# EAGLE design Main_PCB_v2.2 (EAGLE 7.3.0)
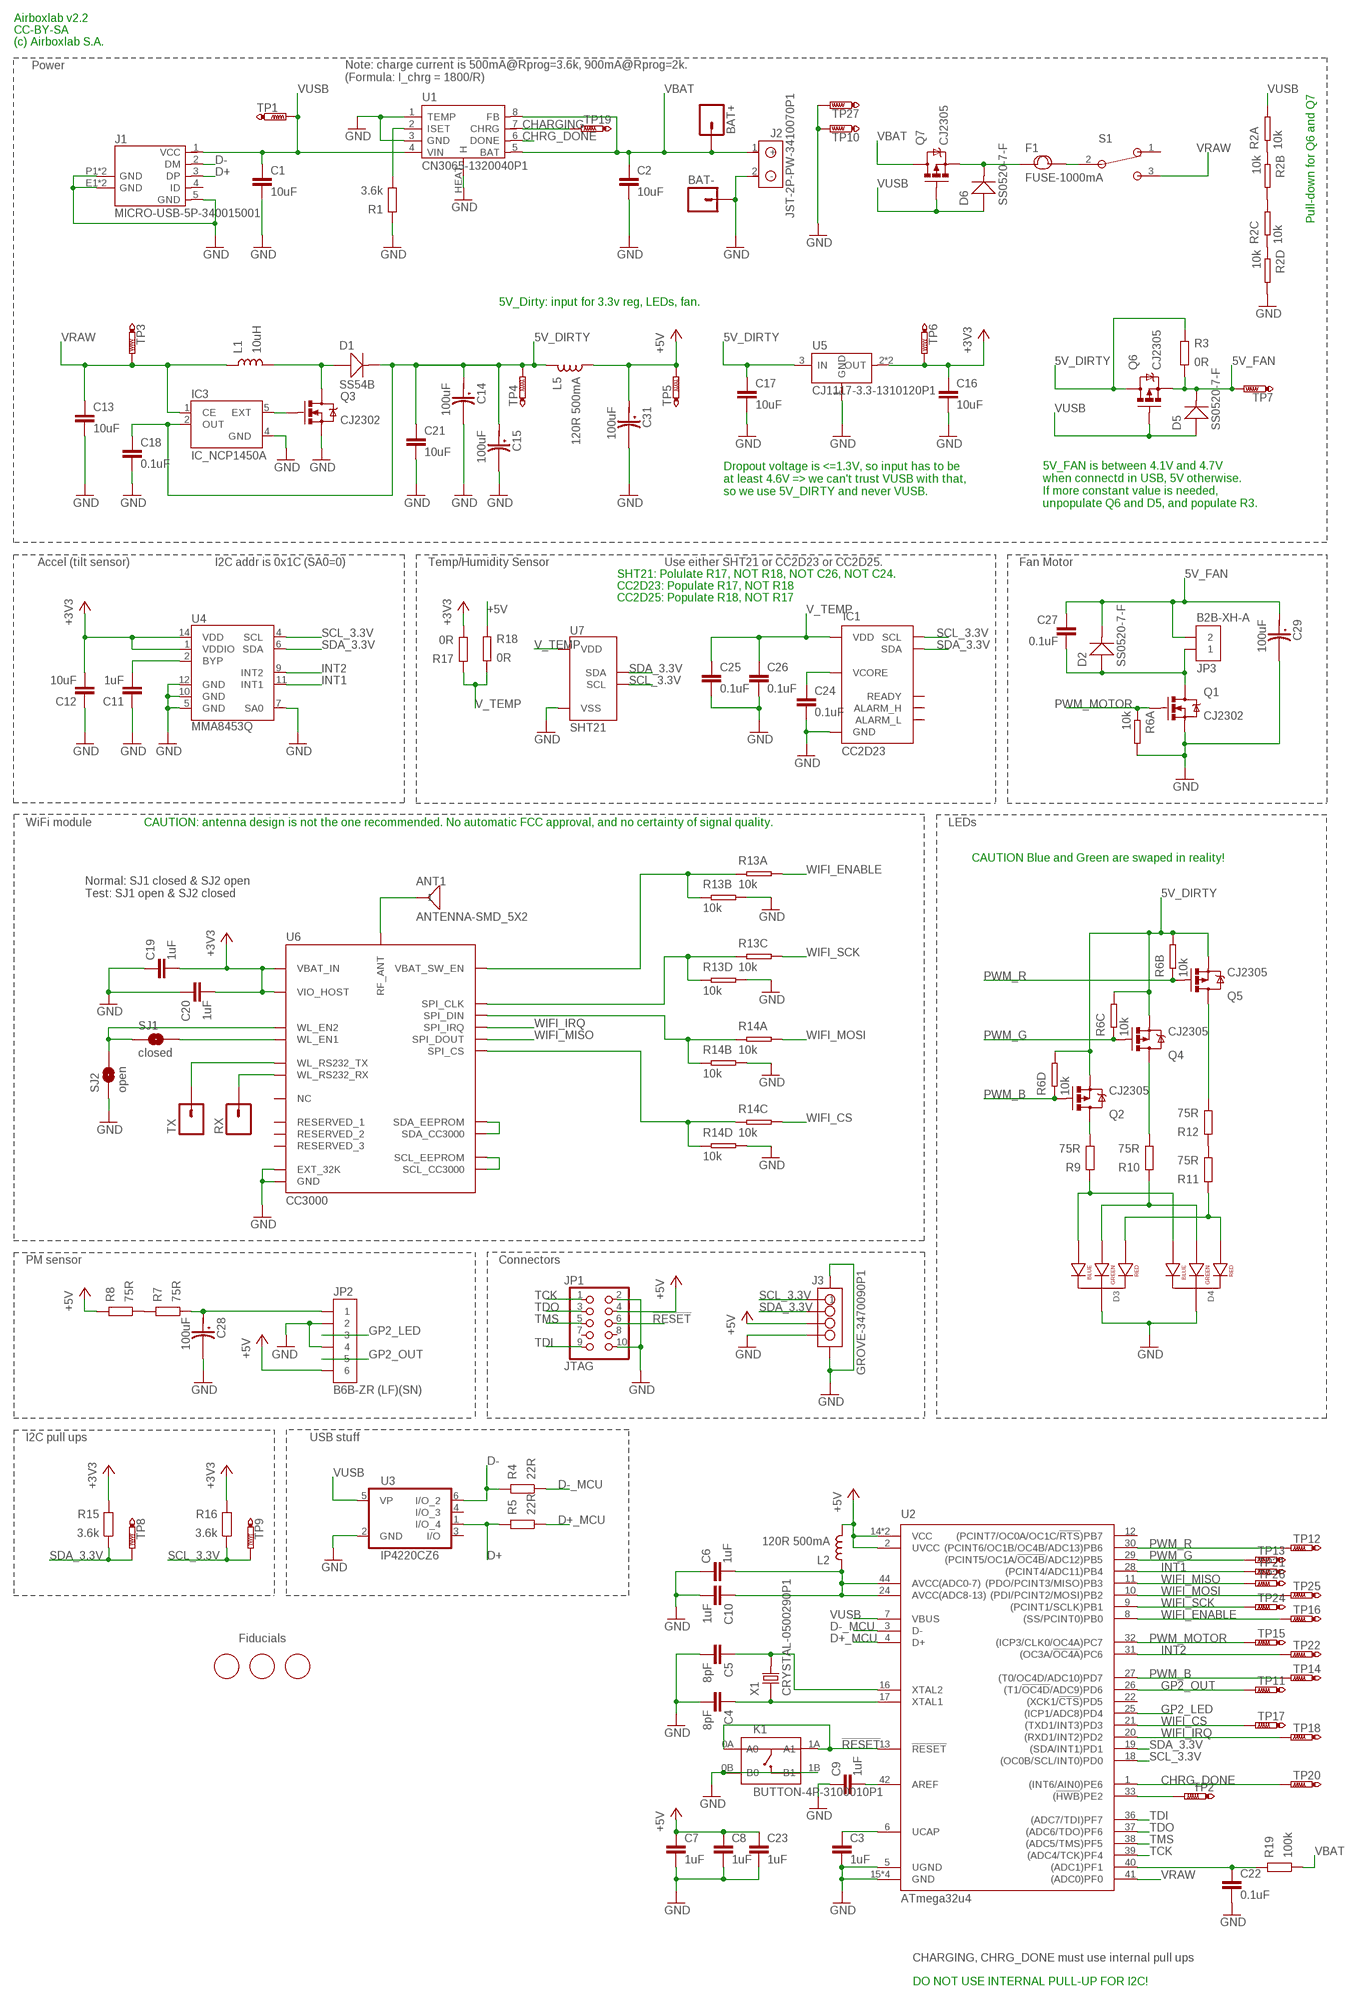
[diagram p0: schematic, sheet 1]

## Parts
ANT1  ANTENNA-SMD_5X2  [ANTENNA_SMD_5X2]
BAT+  M01PTH  [1X01]
BAT-  M01PTH  [1X01]
C1  10uF  C0805  [0805_N]
C2  10uF  C0805  [0805_N]
C3  1uF  C0603  [0603_N]
C4  8pF  C0603  [0603_N]
C5  8pF  C0603  [0603_N]
C6  1uF  C0603  [0603_N]
C7  1uF  C0603  [0603_N]
C8  1uF  C0603  [0603_N]
C9  1uF  C0603  [0603_N]
C10  1uF  C0603  [0603_N]
C11  1uF  C0603  [0603_N]
C12  10uF  C0805  [0805_N]
C13  10uF  C0805  [0805_N]
C14  100uF  C-POLAR-C  [AVX-C]
C15  100uF  C-POLAR-C  [AVX-C]
C16  10uF  C0805  [0805_N]
C17  10uF  C0805  [0805_N]
C18  0.1uF  C0603  [0603_N]
C19  1uF  C0603  [0603_N]
C20  1uF  C0603  [0603_N]
C21  10uF  C0805  [0805_N]
C22  0.1uF  C0603  [0603_N]
C23  1uF  C0603  [0603_N]
C24  0.1uF  C0603  [0603_N]
C25  0.1uF  C0603  [0603_N]
C26  0.1uF  C0603  [0603_N]
C27  0.1uF  C0603  [0603_N]
C28  100uF  C-POLAR-C  [AVX-C]
C29  100uF  C-POLAR-C  [AVX-C]
C31  100uF  C-POLAR-C  [AVX-C]
D1  SS54B  D-SMB  [SMB]
D2  SS0520-7-F  D-SOD-123  [SOD123]
D3  LED-RGB-CC-THRUCLEAR  [LED-RGB-THRU]
D4  LED-RGB-CC-THRUCLEAR  [LED-RGB-THRU]
D5  SS0520-7-F  D-SOD-123  [SOD123]
D6  SS0520-7-F  D-SOD-123  [SOD123]
F1  FUSE-1000mA  FUSE-1206  [F1206]
IC1  CC2D23  CC2DXX  [CC2DXX]
IC3  IC_NCP1450A  [SOT-23-5_N]
J1  MICRO-USB-5P-340015001  [B-SMD-5P]
J2  JST-2P-PW-3410070P1  [2P-2.0-90D]
J3  GROVE-3470090P1  GROVE-4P-2.0-SMD-FEMALE-REINFORCE-3470090P1  [4P-SMD-2.0]
JP1  JTAG  CONNECTOR_5X2_2.54MM_LOCK  [CONNECTOR_2.54MM_5X2_LOCK]
JP2  B6B-ZR (LF)(SN)  CONNECTOR_6X1-ZR-THT  [CONNECTOR_B6B-ZR]
JP3  B2B-XH-A  CONNECTOR_2X1  [CONNECTOR_B2B-XH-A]
K1  BUTTON-4P-3100010P1  [4P-SMD-6.0X6.0X5.0H]
L1  10uH  L-SMD_8X8  [L_SRU8043]
L2  120R 500mA  L0603  [0603_N]
L5  120R 500mA  L0603  [0603_N]
Q1  CJ2302  MOSFET_N_SOT23-3  [SOT-23-3_N/SSOT-3_N]
Q2  CJ2305  MOSFET_P_FDN308P  [SOT-23-3_N/SSOT-3_N]
Q3  CJ2302  MOSFET_N_SOT23-3  [SOT-23-3_N/SSOT-3_N]
Q4  CJ2305  MOSFET_P_FDN308P  [SOT-23-3_N/SSOT-3_N]
Q5  CJ2305  MOSFET_P_FDN308P  [SOT-23-3_N/SSOT-3_N]
Q6  CJ2305  MOSFET_P_FDN308P  [SOT-23-3_N/SSOT-3_N]
Q7  CJ2305  MOSFET_P_FDN308P  [SOT-23-3_N/SSOT-3_N]
R1  3.6k  R0603  [0603_N]
R2  10k  R-4R  [R1206-8]
R3  0R  R0603  [0603_N]
R4  22R  R0603  [0603_N]
R5  22R  R0603  [0603_N]
R6  10k  R-4R  [R1206-8]
R7  75R  R0603  [0603_N]
R8  75R  R0603  [0603_N]
R9  75R  R0603  [0603_N]
R10  75R  R0603  [0603_N]
R11  75R  R0603  [0603_N]
R12  75R  R0603  [0603_N]
R13  10k  R-4R  [R1206-8]
R14  10k  R-4R  [R1206-8]
R15  3.6k  R0603  [0603_N]
R16  3.6k  R0603  [0603_N]
R17  0R  R0603  [0603_N]
R18  0R  R0603  [0603_N]
R19  100k  R0603  [0603_N]
RX  M01PTH  [1X01]
S1  SWITCH_SPDT_ON-ON  [SWITCH_SPDT_OS102011MA1QN1]
SJ1  closed  SOLDERJUMPER2_TRACE2  [SJ_2S-TRACE2]
SJ2  open  SOLDERJUMPER2NO  [SJ_2S-NO]
TP1  PTR1PAD1-13  [P1-13]
TP2  PTR1B1,27  [B1,27]
TP3  PTR1PAD1-13  [P1-13]
TP4  PTR1PAD1-13  [P1-13]
TP5  PTR1PAD1-13  [P1-13]
TP6  PTR1PAD1-13  [P1-13]
TP7  PTR1PAD1-13  [P1-13]
TP8  PTR1PAD1-13  [P1-13]
TP9  PTR1PAD1-13  [P1-13]
TP10  PTR1PAD1-13  [P1-13]
TP11  PTR1PAD1-13  [P1-13]
TP12  PTR1B1,27  [B1,27]
TP13  PTR1B1,27  [B1,27]
TP14  PTR1B1,27  [B1,27]
TP15  PTR1B1,27  [B1,27]
TP16  PTR1B1,27  [B1,27]
TP17  PTR1B1,27  [B1,27]
TP18  PTR1B1,27  [B1,27]
TP19  PTR1B1,27  [B1,27]
TP20  PTR1B1,27  [B1,27]
TP21  PTR1B1,27  [B1,27]
TP22  PTR1B1,27  [B1,27]
TP24  PTR1B1,27  [B1,27]
TP25  PTR1B1,27  [B1,27]
TP26  PTR1B1,27  [B1,27]
TP27  PTR1PAD1-13Y  [P1-13Y]
TX  M01PTH  [1X01]
U1  CN3065-1320040P1  [DFN8]
U2  ATmega32u4  IC_ATMEGAXXU4-MU  [QFN-44_50P_N]
U3  IP4220CZ6  [SOT95P275X110-6N]
U4  MMA8453Q  MMA8452Q  [QFN-16_0.5MM]
U5  CJ1117-3.3-1310120P1  [SOT89]
U6  CC3000  [CC3000]
U7  SHT21  SHT2X-21  [SHT2X]
U$1  FIDUCIAL  [FIDUCIAL_1MM]
U$2  FIDUCIAL  [FIDUCIAL_1MM]
U$3  FIDUCIAL  [FIDUCIAL_1MM]
X1  CRYSTAL-0500290P1  [2P-SMD-5.0X3.2]

## Nets
5V_DIRTY: C14.+ C15.+ C17.1 C18.1 C21.1 D1.- IC3.2(OUT) L5.1 Q2.2(S) Q4.2(S) Q5.2(S) Q6.3(D) R3.2 R6.5 R6.6 R6.7 TP4.TP U5.3(IN)
5V_FAN: C27.1 C29.+ D2.- D5.- JP3.2 Q6.2(S) R3.1 TP7.TP
!RESET!: JP1.6 K1.0A(A0) K1.1A(A1) U2.13(!RESET!)
+3V3: C12.2 C16.1 C19.2 C20.2 R15.2 R16.2 R17.1 TP6.TP U4.1(VDDIO) U4.14(VDD) U5.2(OUT) U5.4(OUT) U6.P$19(VBAT_IN) U6.P$23(VIO_HOST)
+5V: C7.1 C8.1 C23.1 C31.+ J3.3 JP1.4 JP2.P$6 L2.2 L5.2 R8.2 R18.2 TP5.TP U2.2(UVCC) U2.14(VCC) U2.34(VCC)
CHARGING: TP19.TP U1.7(CHRG)
CHRG_DONE: TP20.TP U1.6(DONE) U2.1((INT6/AIN0)PE6)
D+: J1.3(DP) R5.2 U3.1(I/O_4)
D+_MCU: R5.1 U2.4(D+)
D-: J1.2(DM) R4.2 U3.6(I/O_2)
D-_MCU: R4.1 U2.3(D-)
GND: BAT-.1 C1.2 C2.2 C3.2 C4.2 C5.2 C6.1 C7.2 C8.2 C9.1 C10.2 C11.1 C12.1 C13.2 C14.- C15.- C16.2 C17.2 C18.2 C19.1 C20.1 C21.2 C22.2 C23.2 C24.2 C25.2 C26.2 C28.- C29.- C31.- D3.2(CATHODE) D4.2(CATHODE) IC1.P$6(GND) IC3.4(GND) J1.5(GND) J1.E1(GND) J1.E2(GND) J1.P1(GND) J1.P2(GND) J2.2(-) J3.4 J3.SS1 J3.SS2 JP1.2 JP1.10 JP2.P$2 JP2.P$4 K1.0B(B0) K1.1B(B1) Q1.2(S) Q3.2(S) R1.2 R2.5 R6.8 R13.5 R13.7 R14.5 R14.7 SJ2.1 TP10.TP TP27.TP U1.1(TEMP) U1.3(GND) U1.HEAT(H) U2.5(UGND) U2.15(GND) U2.23(GND) U2.35(GND) U2.43(GND) U3.2(GND) U4.5(GND) U4.7(SA0) U4.10(GND) U4.12(GND) U5.1(GND) U6.P$1(GND) U6.P$9(GND) U6.P$10(GND) U6.P$11(GND) U6.P$16(GND) U6.P$18(GND) U6.P$20(GND) U6.P$21(EXT_32K) U6.P$22(GND) U6.P$25(GND) U6.P$31(GND) U6.P$32(GND) U6.P$33(GND) U6.P$34(GND) U6.P$36(GND) U6.P$37(GND) U6.P$38(GND) U6.P$39(GND) U6.P$40(GND) U6.P$41(GND) U6.P$42(GND) U6.P$43(GND) U6.P$44(GND) U6.P$45(GND) U6.P$46(GND) U7.0(VSS) U7.2(VSS)
GP2_LED: JP2.P$3 U2.25((ICP1/ADC8)PD4)
GP2_OUT: JP2.P$5 TP11.TP U2.26((T1/!OC4D!/ADC9)PD6)
INT1: TP21.TP U2.28((PCINT4/ADC11)PB4) U4.11(INT1)
INT2: TP22.TP U2.31((OC3A/!OC4A!)PC6) U4.9(INT2)
N$1: R1.1 U1.2(ISET)
N$2: D6.- F1.1 Q7.2(S)
N$3: D1.+ L1.P$2 Q3.3(D)
N$4: C11.2 U4.2(BYP)
N$5: C3.1 U2.6(UCAP)
N$6: C4.1 U2.17(XTAL1) X1.1
N$7: C5.1 U2.16(XTAL2) X1.2
N$8: C6.2 C10.1 L2.1 U2.24(AVCC(ADC8-13)) U2.44(AVCC(ADC0-7))
N$9: IC3.5(EXT) Q3.1(G)
N$10: U6.P$27(SDA_EEPROM) U6.P$28(SDA_CC3000)
N$11: C9.2 U2.42(AREF)
N$12: F1.2 S1.2
N$13: R2.1 R2.2
N$14: R2.6 R2.7
N$15: R2.3 R2.4
N$16: U6.P$29(SCL_EEPROM) U6.P$30(SCL_CC3000)
N$17: Q5.3(D) R12.1
N$18: Q4.3(D) R10.1
N$19: Q2.3(D) R9.1
N$20: C27.2 D2.+ JP3.1 Q1.3(D)
N$21: C28.+ JP2.P$1 R7.1
N$22: C22.1 R19.2 U2.40((ADC1)PF1)
N$23: R7.2 R8.1
N$24: C24.1 IC1.P$5(VCORE)
N$25: TX.1 U6.P$6(WL_RS232_TX)
N$26: SJ1.2 U6.P$7(WL_EN1)
N$27: SJ1.1 SJ2.2 U6.P$5(WL_EN2)
N$28: RX.1 U6.P$8(WL_RS232_RX)
N$29: ANT1.1 U6.P$35(RF_ANT)
N$32: D3.4(BLUE_CATHODE) D4.4(BLUE_CATHODE) R9.2
N$33: D3.3(GREEN_CATHODE) D4.3(GREEN_CATHODE) R10.2
N$34: R11.1 R12.2
N$37: D3.1(RED_CATHODE) D4.1(RED_CATHODE) R11.2
N$39: R14.3 R14.4 U6.P$12(SPI_CS)
N$40: R14.1 R14.2 U6.P$15(SPI_DIN)
N$41: R13.3 R13.4 U6.P$17(SPI_CLK)
N$42: R13.1 R13.2 U6.P$26(VBAT_SW_EN)
N$43: TP2.TP U2.33((!HWB!)PE2)
PWM_B: Q2.1(G) R6.4 TP14.TP U2.27((T0/OC4D/ADC10)PD7)
PWM_G: Q4.1(G) R6.3 TP13.TP U2.29((PCINT5/OC1A/!OC4B!/ADC12)PB5)
PWM_MOTOR: Q1.1(G) R6.1 TP15.TP U2.32((ICP3/CLK0/OC4A)PC7)
PWM_R: Q5.1(G) R6.2 TP12.TP U2.30((PCINT6/OC1B/OC4B/ADC13)PB6)
SCL_3.3V: IC1.P$4(SCL) J3.1 R16.1 TP9.TP U2.18((OC0B/SCL/INT0)PD0) U4.4(SCL) U7.6(SCL)
SDA_3.3V: IC1.P$3(SDA) J3.2 R15.1 TP8.TP U2.19((SDA/INT1)PD1) U4.6(SDA) U7.1(SDA)
TCK: JP1.1 U2.39((ADC4/TCK)PF4)
TDI: JP1.9 U2.36((ADC7/TDI)PF7)
TDO: JP1.3 U2.37((ADC6/TDO)PF6)
TMS: JP1.5 U2.38((ADC5/TMS)PF5)
V_TEMP: C25.1 C26.1 IC1.P$7(VDD) R17.2 R18.1 U7.5(VDD)
VBAT: BAT+.1 C2.1 J2.1(+) Q7.3(D) R19.1 U1.5(BAT) U1.8(FB)
VRAW: C13.1 IC3.1(CE) L1.P$1 S1.3 TP3.TP U2.41((ADC0)PF0)
VUSB: C1.1 D5.+ D6.+ J1.1(VCC) Q6.1(G) Q7.1(G) R2.8 TP1.TP U1.4(VIN) U2.7(VBUS) U3.5(VP)
WIFI_CS: R14.6 TP17.TP U2.21((TXD1/INT3)PD3)
WIFI_ENABLE: R13.8 TP16.TP U2.8((SS/PCINT0)PB0)
WIFI_IRQ: TP18.TP U2.20((RXD1/INT2)PD2) U6.P$14(SPI_IRQ)
WIFI_MISO: TP26.TP U2.11((PDO/PCINT3/MISO)PB3) U6.P$13(SPI_DOUT)
WIFI_MOSI: R14.8 TP25.TP U2.10((PDI/PCINT2/MOSI)PB2)
WIFI_SCK: R13.6 TP24.TP U2.9((PCINT1/SCLK)PB1)
Unconnected: IC1.P$1(ALARM_L) IC1.P$2(READY) IC1.P$8(ALARM_H) J1.4(ID) JP1.7 JP1.8 S1.1 U2.12((PCINT7/OC0A/OC1C/!RTS!)PB7) U2.22((XCK1/!CTS!)PD5) U3.3(I/O) U3.4(I/O_3) U6.P$2(RESERVED_1) U6.P$3(NC) U6.P$4(RESERVED_2) U6.P$24(RESERVED_3)

## Notes on the sheet
- Airboxlab v2.2
- CC-BY-SA
- (c) Airboxlab S.A.
- Power
- Note: charge current is 500mA@Rprog=3.6k, 900mA@Rprog=2k.
  (Formula: I_chrg = 1800/R)
- Pull-down for Q6 and Q7
- 5V_Dirty: input for 3.3v reg, LEDs, fan.
- Dropout voltage is <=1.3V, so input has to be
  at least 4.6V => we can't trust VUSB with that,
  so we use 5V_DIRTY and never VUSB.
- 5V_FAN is between 4.1V and 4.7V
  when connectd in USB, 5V otherwise.
  If more constant value is needed,
  unpopulate Q6 and D5, and populate R3.
- Accel (tilt sensor) | I2C addr is 0x1C (SA0=0) | Temp/Humidity Sensor | Use either SHT21 or CC2D23 or CC2D25. | Fan Motor
- SHT21: Polulate R17, NOT R18, NOT C26, NOT C24.
- CC2D23: Populate R17, NOT R18
- CC2D25: Populate R18, NOT R17
- WiFi module | CAUTION: antenna design is not the one recommended. No automatic FCC approval, and no certainty of signal quality. | LEDs
- CAUTION Blue and Green are swaped in reality!
- Normal: SJ1 closed & SJ2 open
  Test: SJ1 open & SJ2 closed
- PM sensor | Connectors
- I2C pull ups | USB stuff
- Fiducials
- CHARGING, CHRG_DONE must use internal pull ups
- DO NOT USE INTERNAL PULL-UP FOR I2C!

## Library data of the parts
ANT1 = AirQuality-sensors:ANTENNA
BAT+ BAT- RX TX = SparkFun-Connectors:M01: Header 1 Standard 1-pin 0.1" header. Use with straight break away headers (SKU : PRT-00116), right angle break away headers (PRT-00553), swiss pins (PRT-00743), machine pins (PRT-00117), and female headers (PRT-00115).
C1-C13 C16-C27 = Xevelabs:C: Non-polarized Capacitor
C14 C15 C28 C29 C31 = OPL:C-POLAR*
D1 D2 D5 D6 = OPL:D*: DIODE
D3 D4 = SparkFun-LED:LED-RGB-CC-THRU: RGB Through-hole common cathode LED SparkFun Storefront: COM-00105 (Clear) COM-09264 (Diffuse); PROD_ID: DIO-08418
F1 = OPL:FUSE*
IC1 = AirQuality-sensors:CC2DXX
IC3 = Xevelabs:IC_NCP1450A: NCP1450A switching step-up voltage regulator
J1 = OPL:MICRO-USB-5P: ST-USB-001E：MICRO USB B SMD R/A
J2 = OPL:JST-2P-PW
J3 = OPL:GROVE-4P-2.0-SMD-FEMALE-REINFORCE
JP1 = AirQuality-sensors:CONNECTOR_5X2
JP2 = AirQuality-sensors:CONNECTOR_6X1
JP3 = AirQuality-sensors:CONNECTOR_2X1
K1 = OPL:BUTTON-4P
L1 = AirQuality-sensors:L
L2 L5 = Xevelabs:L
Q1 Q3 = Xevelabs:MOSFET_N
Q2 Q4-Q7 = Xevelabs:MOSFET_P
R1 R3-R5 R7-R12 R15-R19 = Xevelabs:R: Resistor
R2 R6 R13 R14 = OPL:R-4R*: Resistor Array
S1 = AirQuality-sensors:SWITCH_SPDT_ON-ON
SJ1 SJ2 = Xevelabs:SOLDERJUMPER2: Solder Jumper Standard SMD solder jumper. Used to automate production. Two varients : Normally Open and Normally Closed are the same, but have different paste layers. NC will have a large amount of paste and should jumper during reflow.
TP1-TP22 TP24-TP27 = testpad:PTR1: TEST PIN
U1 = OPL:CN3065: USB-Compatible Lithiumt-Ion Battery Charger with Thermal Regulation http://www.consonance-elec.com/pdf/%E6%8A%80%E6%9C%AF%E8%AF%B4%E6%98%8E%E4%B9%A6/DSC-CN3065.pdf
U2 = Xevelabs:IC_ATMEGAXXU4
U3 = AirQuality-sensors:IP4220CZ6: Dual Schmitt-Trigger Inverter; MPN: IP4220CZ6; OC_FARNELL: 1506629; OC_NEWARK: 61M6815; PACKAGE: SSOT-6; SUPPLIER: NXP
U4 = SparkFun:MMA8452Q: MMA8452Q 3-Axis, 12/8-bit Digital Accelerometer Supply Voltage: 1.6-3.6V Range: +/- 2g, 4g, 8g Interface: I2C, 12-bit and 8-bit ODR: 1.56 Hz - 800 Hz Package: QFN-16 http://cache.freescale.com/files/sensors/doc/data_sheet/MMA8452Q.pdf
U5 = OPL:CJ1117-3.3: 1A Low Dropout Linear Regulator
U6 = centerblack_engineering:CC3000: TI SimpleLink CC3000 Module - WiFi 802.11b/g Network Processor; AUTHOR: Matt Bigarani; DATASHEET: http://www.ti.com/lit/ds/symlink/cc3000.pdf; DATE: 2/8/2013; MODIFIED_BY: Xevelabs
U7 = AirQuality-sensors:SHT2X: SHT2X Humidity and Temperature Sensor SHT20 SHT21 SHT25
U$1-U$3 = adafruit:FIDUCIAL: For use by pick and place machines to calibrate the vision/machine, 1mm By microbuilder.eu
X1 = OPL:CRYSTAL*

## Board
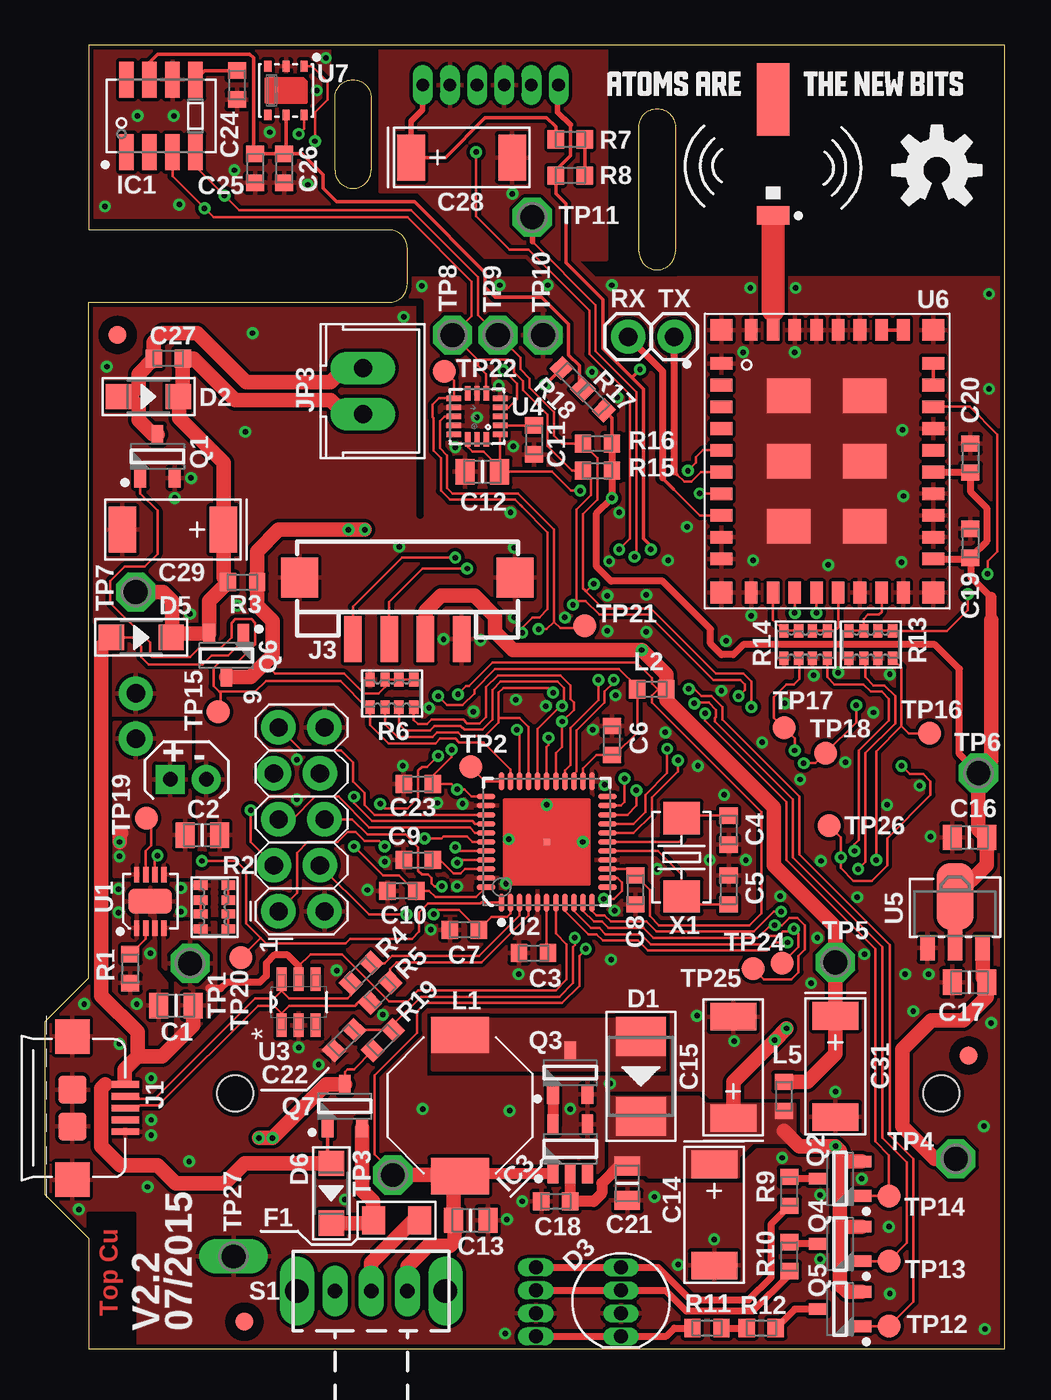
[diagram p1: board, top side]
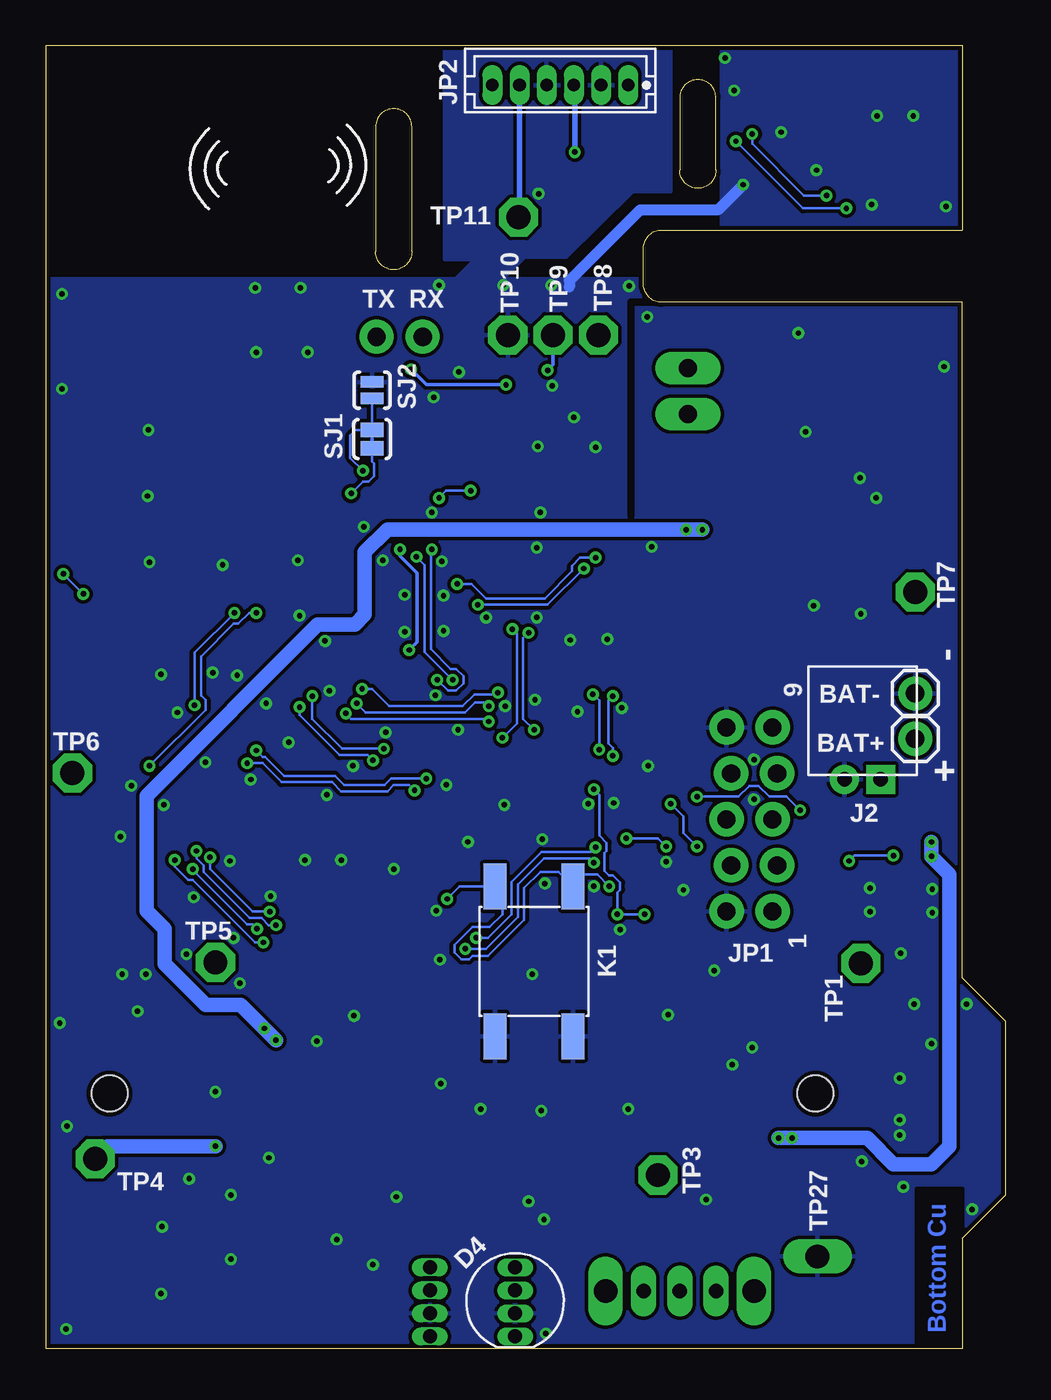
[diagram p2: board, bottom side, seen from below]

Size 53 x 72 mm. Coordinates in mm from the lower left corner, seen from the top.
Outline: 2.4,0 53,0 53,72 2.4,72 2.4,61.8 19,61.8 arc-90 20,60.8 20,58.8 arc-90 19,57.8 2.4,57.8 2.4,20.5 0,18.1 0,8.5 2.4,6.1 2.4,0
Outline: 18,69.1 18,65.1 arc-180 16,65.1 16,69.1 arc-180 18,69.1
Outline: 34.8,67.5 34.8,60.6 arc-180 32.8,60.6 32.8,67.5 arc-180 34.8,67.5
Copper layers (1*16): Top 0.035mm / dielectric 1.55mm / Bottom 0.035mm
Design rules "Xevelabs_6mil_eurocircuits *": minimum track width 0.15mm, minimum drill 0.25mm, track to track 0.195mm, track to pad 0.155mm, pad to pad 0.155mm, via to via 0.155mm, smd to smd 0mil, copper to edge 0.25mm, drill to drill 0.25mm, minimum pad ring 0mil, minimum via ring 0.177mm, stop-mask expansion 0mil, vias tented up to drill 100mil, thermal gap 0.2mm
Holes 2 mm at 10.5,14.1 49.5,14.1
bKeepout: area 8,11.6 to 13,16.6; area 47,11.6 to 52,16.6
tRestrict: 5 lines
bRestrict: 5 lines

### Footprints (pad centres in the part's own frame; a part is rotated, then mirrored left to right if it is on the bottom)
ANTENNA_SMD_5X2 = smd 1 x 1.8: 1 -2,0 | smd 4 x 1.8: 2 4.4,0
1X01 = drill 1.016 pad 1.88: 1 0,0
0805_N = smd 1.05 x 1.4: 1 -0.95,0; 2 0.95,0
0603_N = smd 0.9 x 1: 1 -0.8,0; 2 0.8,0
AVX-C = smd 1.524 x 2.54: + -2.794,0; - 2.794,0
SMB = smd 2.159 x 2.743: + -2.21,0; - 2.21,0
SOD123 = smd 1.397 x 1.397: + -1.651,0; - 1.651,0
LED-RGB-THRU = drill 0.762 pad 0.889 long: 1 1.905,0; 2 0.635,0; 3 -0.635,0; 4 -1.905,0
F1206 = smd 1.27 x 1.524: 1 -1.27,0; 2 1.27,0
CC2DXX = smd 2 x 0.8: P$1 2,-1.905; P$2 2,-0.635; P$3 2,0.635; P$4 2,1.905; P$5 -2,1.905; P$6 -2,0.635; P$7 -2,-0.635; P$8 -2,-1.905
SOT-23-5_N = smd 1.1 x 0.6: 1 -1.35,0.95; 2 -1.35,0; 3 -1.35,-0.95; 4 1.35,-0.95; 5 1.35,0.95
B-SMD-5P = smd 0.38 x 1.52: 1 -1.3,2.921; 2 -0.65,2.921; 3 0,2.921; 4 0.65,2.921; 5 1.3,2.921 | smd 1.524 x 1.524: E1 -1.016,0; E2 1.016,0 | smd 1.9 x 1.9: P1 -3.95,0; P2 3.95,0
2P-2.0-90D = drill 0.8 pad 1.6 square: 1 -1,3.25 | drill 0.8 pad 1.6: 2 1,3.25
4P-SMD-2.0 = smd 0.965 x 2.54: 1 -3,0; 2 -1,0; 3 1,0; 4 3,0 | smd 2.032 x 2.184: SS1 -5.946,3.4; SS2 5.946,3.4
CONNECTOR_2.54MM_5X2_LOCK = drill 1 pad 1.9: 1 -5.08,-1.27; 2 -5.08,1.27; 3 -2.54,-1.524; 4 -2.54,1.016; 5 0,-1.27; 6 0,1.27; 7 2.54,-1.524; 8 2.54,1.016; 9 5.08,-1.27; 10 5.08,1.27
CONNECTOR_B6B-ZR = drill 0.7 pad 1.1 long: P$1 0,3.75; P$2 0,2.25; P$3 0,0.75; P$4 0,-0.75; P$5 0,-2.25; P$6 0,-3.75
CONNECTOR_B2B-XH-A = drill 1 pad 1.8 long: 1 0,1.27; 2 0,-1.27
4P-SMD-6.0X6.0X5.0H = smd 2.54 x 1.27: 0A -4.129,2.159; 0B 4.129,2.159; 1A -4.129,-2.159; 1B 4.129,-2.159
L_SRU8043 = smd 2 x 3.2: P$1 -3.9,0; P$2 3.9,0
SOT-23-3_N/SSOT-3_N = smd 1.05 x 0.65: 1 -1.2,0.95; 2 -1.2,-0.95; 3 1.2,0
R1206-8 = smd 0.508 x 0.762: 1 -1.206,-0.762; 2 -0.381,-0.762; 3 0.381,-0.762; 4 1.206,-0.762; 5 1.206,0.762; 6 0.381,0.762; 7 -0.381,0.762; 8 -1.206,0.762
SWITCH_SPDT_OS102011MA1QN1 = drill 0.8 pad 1.4 long: 1 -2,0; 2 0,0; 3 2,0 | drill 1.3 pad 1.9 long: S1 -4.1,0; S2 4.1,0
SJ_2S-TRACE2 = smd 0.8 x 1.27: 1 -0.508,0; 2 0.508,0
SJ_2S-NO = smd 0.635 x 1.27: 1 -0.45,0; 2 0.45,0
P1-13 = drill 1.321 pad 2.159 octagon: TP 0,0
B1,27 = smd 1.27 x 1.27: TP 0,0
P1-13Y = drill 1.321 pad 1.905 long: TP 0,0
DFN8 = smd 0.854 x 0.3: 1 -1.477,0.75; 2 -1.477,0.25; 3 -1.477,-0.25; 4 -1.477,-0.75; 5 1.477,-0.75; 6 1.477,-0.25; 7 1.477,0.25; 8 1.477,0.75 | smd 1.397 x 2.413: HEAT 0,0
QFN-44_50P_N = smd 1 x 0.3: 1 -3.35,2.5; 2 -3.35,2; 3 -3.35,1.5; 4 -3.35,1; 5 -3.35,0.5; 6 -3.35,0; 7 -3.35,-0.5; 8 -3.35,-1; 9 -3.35,-1.5; 10 -3.35,-2; 11 -3.35,-2.5; 23 3.35,-2.5; 24 3.35,-2; 25 3.35,-1.5; 26 3.35,-1; 27 3.35,-0.5; 28 3.35,0; 29 3.35,0.5; 30 3.35,1; 31 3.35,1.5; 32 3.35,2; 33 3.35,2.5 | smd 0.3 x 1: 12 -2.5,-3.35; 13 -2,-3.35; 14 -1.5,-3.35; 15 -1,-3.35; 16 -0.5,-3.35; 17 0,-3.35; 18 0.5,-3.35; 19 1,-3.35; 20 1.5,-3.35; 21 2,-3.35; 22 2.5,-3.35; 34 2.5,3.35; 35 2,3.35; 36 1.5,3.35; 37 1,3.35; 38 0.5,3.35; 39 0,3.35; 40 -0.5,3.35; 41 -1,3.35; 42 -1.5,3.35; 43 -2,3.35; 44 -2.5,3.35 | smd 0.35 x 0.35: 45 0,0
SOT95P275X110-6N = smd 1.321 x 0.559: 1 -1.27,0.94; 2 -1.27,0; 3 -1.27,-0.94; 4 1.27,-0.94; 5 1.27,0; 6 1.27,0.94
QFN-16_0.5MM = smd 0.8 x 0.3: 1 -1.275,1; 2 -1.275,0.5; 3 -1.275,0; 4 -1.275,-0.5; 5 -1.275,-1; 9 1.275,-1; 10 1.275,-0.5; 11 1.275,0; 12 1.275,0.5; 13 1.275,1 | smd 0.3 x 0.8: 6 -0.5,-1.275; 7 0,-1.275; 8 0.5,-1.275; 14 0.5,1.275; 15 0,1.275; 16 -0.5,1.275
SOT89 = smd 0.8 x 1.4: 1 -1.524,-1.905; 3 1.524,-1.905 | smd 0.8 x 1.9: 2 0,-1.651 | smd 2.032 x 3.65: 4 0,0.94
CC3000 = smd 1.2 x 0.7: P$1 -5.85,5.33; P$2 -5.85,4.13; P$3 -5.85,2.93; P$4 -5.85,1.73; P$5 -5.85,0.53; P$6 -5.85,-0.67; P$7 -5.85,-1.87; P$8 -5.85,-3.07; P$9 -5.85,-4.27; P$10 -5.85,-5.47; P$19 5.85,-5.47; P$20 5.85,-4.27; P$21 5.85,-3.07; P$22 5.85,-1.87; P$23 5.85,-0.67; P$24 5.85,0.53; P$25 5.85,1.73; P$26 5.85,2.93; P$27 5.85,4.13; P$28 5.85,5.33 | smd 0.7 x 1.2: P$11 -4.2,-7.32; P$12 -3,-7.32; P$13 -1.8,-7.32; P$14 -0.6,-7.32; P$15 0.6,-7.32; P$16 1.8,-7.32; P$17 3,-7.32; P$18 4.2,-7.32; P$29 4.2,7.18; P$30 3,7.18; P$31 1.8,7.18; P$32 0.6,7.18; P$33 -0.6,7.18; P$34 -1.8,7.18; P$35 -3,7.18; P$36 -4.2,7.18 | smd 2.4 x 1.9: P$37 -2.15,3.53; P$38 -2.15,-0.07; P$39 -2.15,-3.67; P$40 2.05,3.53; P$41 2.05,-0.07; P$42 2.05,-3.67 | smd 1.2 x 1.2: P$43 -5.85,7.18; P$44 -5.85,-7.32; P$45 5.85,-7.32; P$46 5.85,7.18
SHT2X = smd 0.305 x 0.152: 0 0.05,0.5 | smd 0.6 x 0.4: 1 1.35,-1; 2 1.35,0; 3 1.35,1; 4 -1.35,1; 5 -1.35,0; 6 -1.35,-1
FIDUCIAL_1MM = smd 1 x 1: 1 0,0
2P-SMD-5.0X3.2 = smd 1.778 x 2.032: 1 -2.159,0; 2 2.159,0

### Placement (x,y rotation side)
ANT1  40.2,64.6 90 top
BAT+  5,33.7 0 bottom
BAT-  5,36.2 0 bottom
C1  7.22,18.96 180 top
C2  8.67,28.38 0 top
C3  26.97,21.86 180 top
C4  37.75,28.65 270 top
C5  37.75,25.35 90 top
C6  31.3,33.6 270 top
C7  23.15,23.15 180 top
C8  32.6,25.35 270 top
C9  20.6,27 0 top
C10  19.7,25.3 180 top
C11  27,50.2 90 top
C12  24.15,48.45 0 top
C13  23.5,7.1 0 top
C14  36.95,7.4 270 top
C15  38,15.55 90 top
C16  51.05,28.25 180 top
C17  51.05,20.25 180 top
C18  28.2,8.15 180 top
C19  51.1,44.5 270 top
C20  51.1,49.2 270 top
C21  32.15,9.15 270 top
C22  16.5,17.05 225 top
C23  20.6,31.2 180 top
C24  10.6,69.8 270 top
C25  11.6,65.2 270 top
C26  13.2,65.2 270 top
C27  6.8,54.7 180 top
C28  23,65.8 0 top
C29  7.05,45.25 180 top
C31  43.65,15.6 270 top
D1  32.9,15.05 270 top
D2  5.7,52.6 0 top
D3  31.8,2.6 270 top
D4  27.1,2.6 270 bottom
D5  5.3,39.3 0 top
D6  15.8,8.6 270 top
F1  19.4,7.1 0 top
IC1  6.4,68.1 270 top
IC3  29,11.05 90 top
J1  1.5,13.3 270 top
J2  7.9,34.7 180 bottom
J3  20,39.2 0 top
JP1  14.15,29.25 90 bottom
JP2  24.6,69.8 270 bottom
JP3  17.55,52.9 0 top
K1  26.05,21.4 270 bottom
L1  22.9,13.45 90 top
L2  33.5,36.43 0 top
L5  40.8,13.95 90 top
Q1  6.2,49.3 90 top
Q2  43.9,9.4 180 top
Q3  29,15.25 90 top
Q4  43.9,5.8 180 top
Q5  43.9,2.2 180 top
Q6  10,38.3 270 top
Q7  16.55,13.4 90 top
R1  4.7,21 270 top
R2  9.35,24.4 90 top
R3  10.9,42.35 0 top
R4  17.44,20.76 225 top
R5  18.5,19.7 225 top
R6  19.15,36.2 0 top
R7  29,66.8 0 top
R8  29,64.8 180 top
R9  41.1,8.7 270 top
R10  41.1,5.1 270 top
R11  36.55,1.15 180 top
R12  39.55,1.15 180 top
R13  45.6,38.9 180 top
R14  42,38.9 180 top
R15  30.5,48.5 0 top
R16  30.5,50 0 top
R17  30.3,52.4 135 top
R18  29.1,53.6 135 top
R19  18.65,17.05 45 top
RX  32.2,55.9 180 top
S1  18,3.2 0 top
SJ1  35,50.25 270 bottom
SJ2  35,52.95 270 bottom
TP1  8,21.3 0 top
TP2  23.5,32.15 270 top
TP3  19.2,9.6 0 top
TP4  50.3,10.5 0 top
TP5  43.65,21.35 0 top
TP6  51.55,31.8 270 top
TP7  5,41.8 0 top
TP8  22.5,56 0 top
TP9  25,56 0 top
TP10  27.5,56 0 top
TP11  26.9,62.5 0 top
TP12  46.6,1.25 0 top
TP13  46.6,4.85 315 top
TP14  46.6,8.45 315 top
TP15  9.55,35.2 0 top
TP16  48.85,34 0 top
TP17  40.8,34.3 0 top
TP18  43.1,32.9 0 top
TP19  5.6,29.3 90 top
TP20  10.8,21.6 90 top
TP21  29.8,39.95 0 top
TP22  22.05,54 0 top
TP24  40.7,21.3 0 top
TP25  39.1,21 0 top
TP26  43.3,28.9 0 top
TP27  10.4,5.1 90 top
TX  34.75,55.9 180 top
U1  5.8,24.72 90 top
U2  27.7,28 90 top
U3  14,19.15 90 top
U4  23.85,51.5 180 top
U5  50.25,24.05 0 top
U6  43.2,49.1 0 top
U7  13.3,69.5 90 top
U$1  11,1.5 0 top
U$2  4,56 0 top
U$3  51,16.2 0 top
U$4  [OSHW-LOGO-M]  49.25,65.1 0 top
X1  35.15,27.15 270 top

### Tracks (layer width: path | path; a pad name or v marks a point on that pad's centre or on a via)
5V_DIRTY  (via drill 0.3)
  Top 0.15: R6.5 R6.6 R6.7 18.77,36.57 18.4,36.2 17.6,36.2 16.5,37.3 12.7,37.3 12.12,37.88
  Top 0.6: IC3.2 C18.1 30.3,8.15 30.75,8.6 30.75,9.15 31.7,10.1 C21.1
  Top 0.8: 40.8,12.05 41.65,11.2 v43.65,11.2 43.9,10.95 43.9,10.35 | C15.+ 38,14.75 v40.3,17.05 v40.95,17.7 | Q6.3 11.35,37.1 12.12,37.88 12.55,38.3 12.55,40.2 11.7,41.05 R3.2 11.7,44.05 12.9,45.25 v16.75,45.25 v17.65,45.25 | U5.3 51.77,20.48 C17.1 52,19.45 50.7,18.15 48.95,18.15 47.35,16.55 47.35,12.3 49.15,10.5 TP4.TP | Q5.2 44.3,3.15 43.9,3.55 43.9,6.75 | 43.9,6.75 43.9,10.35 | Q2.2 43.9,10.35 | Q4.2 43.9,6.75
  Bottom 0.8: v16.75,45.25 v17.65,45.25 34.15,45.25 35.4,44 35.4,40.55 35.95,40 38,40 47.45,30.55 47.45,24.2 46.45,23.2 46.45,21.25 44.2,19 42.25,19 v40.95,17.7 v40.3,17.05 | v43.65,11.2 49.6,11.2 TP4.TP
  pour Top (no thermals): 31.2,13.9 36.1,13.9 36.5,13.5 41.4,13.5 41.4,11.8 41,11.4 39.1,11.4 38.3,10.6 38.3,9.5 33.35,9.5 33.2,9.65 31.2,9.65
5V_FAN
  Top 0.8: TP7.TP 6.5,41.8 7,41.3 7,39.35 D5.- 7.15,39.5 Q6.2 9.05,41.3 R3.1 9.84,42.61 C29.+ 9.84,48.96 7.4,51.4 7.4,52.55 D2.- 7.6,52.85 C27.1 8.2,54.7 10.5,52.4 15.75,52.4 16.5,51.65 17.53,51.65 JP3.2
!RESET!  (via drill 0.3)
  Top 0.15: v30.85,24.85 31.4,24.85 31.85,25.3 31.85,25.75 31.6,26 U2.13 | v21.9,25.55 21.5,25.55 21.35,25.7 21.35,26 21.15,26.2 20.8,26.2 20.6,26.4 20.6,27.7 19.9,28.4 17.8,28.4 16.95,29.25 JP1.6
  Bottom 0.15: v30.85,24.85 30.17,25.53 K1.1A 27.8,25.12 27.8,24 28.5,23.3 29.45,23.3 30.45,22.3 30.45,21.9 30.05,21.5 29.65,21.5 29.45,21.7 28.6,21.7 26.6,23.7 26.6,25.45 25.7,26.35 24.71,26.35 K1.0A 23.89,25.61 23.3,26.2 22.55,26.2 v21.9,25.55
+3V3  (via drill 0.3)
  Top 0.15: U4.14 23.35,49.8 23.6,49.55 24.2,49.55 24.75,49 24.75,48.8 C12.2 | U4.1 25.12,48.47 C12.2 | C12.2 28,48.45 29.05,47.4 v29.55,47.4
  Top 0.2: R16.2 31.3,51.4 R17.1
  Top 0.4: U6.P$23 51.07,48.43 C20.2 51.1,47.35 52,46.45 52,44.6 C19.2 | U6.P$19 51.03,43.63 C19.2 | 52.25,41.5 51.15,42.6 51.15,43.65 C19.2 | TP6.TP 50.5,32.85 50.5,37.55 49.15,38.9 38.55,38.9 38,38.35 37.35,38.35 36.75,38.95 36.75,39.75 34.1,42.4 31.25,42.4 30.45,43.2 30.45,46.15 v31.3,47 R15.2 R16.2
  Top 0.6: 52.25,40.25 52.25,41.5
  Top 0.8: U5.2 U5.4 52,26.74 C16.1 51.55,28.7 TP6.TP 52.25,32.5 52.25,40.25
  Bottom 0.15: v29.55,47.4 30.9,47.4 v31.3,47
+5V  (via drill 0.3)
  Top 0.15: U2.14 32.25,26.5 C8.1 33.4,25.35 33.4,23.9 33.9,23.4 38.9,23.4 39.55,24.05 39.55,29.65 33.5,35.7 33.5,36.1 33.83,36.43 | U2.2 25.7,24.05 25.5,23.85 24.65,23.85 C7.1 22.85,24.25 21.7,24.25 v21.45,24 | U2.34 23.55,30.5 23.15,30.9 v22.75,30.9 22.45,31.2 C23.1 21.4,31.65 22.45,32.7 v22.45,33.1 | v19.95,24 17.88,24 JP1.4 | L2.2 33.83,36.43 | 33.83,36.43 33.5,36.76 33.5,37.05 32.65,37.9 24.7,37.9 23.4,36.6 23.25,36.6 v22.8,36.15
  Top 0.2: 29,67.6 29,65.9 28.2,65.1 R8.2 28.2,63.8 28.75,63.25 28.75,60 30.8,57.95 30.8,55.25 32.4,53.65 | 28.3,69.75 JP2.P$6 | 32.4,53.65 33.05,53 33.05,44.75 33.45,44.35 v33.45,44.15 | 32.4,53.65 v32.85,54.1 | v27.6,53.25 27.62,53.25 R18.2
  Top 0.3: 29,67.6 28.3,68.3 28.3,69.75
  Top 0.8: L5.2 42.1,14.75 43.65,16.3 C31.+ TP5.TP 43.65,23.3 40.25,26.7 40.25,29.9 34.3,35.85 L2.2 34.3,37.25 v32.95,38.6 25.85,38.6 24.85,39.6 24.85,40.45 23.7,41.6 21.85,41.6 21,40.75 J3.3
  Bottom 0.15: v22.75,30.9 22.45,30.6 22.45,28.35 22.05,27.95 22.05,27.5 22.15,27.4 22.15,26.4 21.9,26.15 21.7,26.15 21.3,25.75 21.3,25.35 21.45,25.2 v21.45,24 v19.95,24 | v22.8,36.15 22.45,35.8 v22.45,33.1
  Bottom 0.2: v32.95,38.6 32.5,39.05 32.5,42.85 33.45,43.8 v33.45,44.15 | v27.6,53.25 32,53.25 v32.85,54.1
CHARGING
  Top 0.15: U1.7 5.55,27.5 5.85,27.8 5.85,29.05 TP19.TP
CHRG_DONE  (via drill 0.3)
  Top 0.15: U1.6 6.05,27.1 v6.2,27.25 | v8.65,26.95 10.55,26.95 11.1,26.4 11.1,23.5 11.9,22.7 | 11.9,22.7 12.2,22.4 16.6,22.4 16.85,22.65 20.25,22.65 20.65,23.05 20.65,24.1 21.15,24.6 24.05,24.6 24.1,24.65 U2.1 | TP20.TP 11.9,22.7
  Bottom 0.15: v6.2,27.25 8.35,27.25 v8.65,26.95
D+
  Top 0.15: J1.3 5.1,13.3 5.25,13.45 6.25,13.45 11.75,18.95 12.65,18.95 13.06,18.54 | U3.1 13.06,18.54 | 13.06,18.54 13.47,18.95 17.1,18.95 17.28,19.13 R5.2
D+_MCU
  Top 0.15: U2.4 26.7,23.95 24.1,21.35 19.4,21.35 19.05,21 19.05,20.28 R5.1
D-
  Top 0.15: J1.2 5.1,13.95 5.25,13.8 6.05,13.8 11.6,19.35 12.65,19.35 13.06,19.76 | U3.6 13.06,19.76 | 13.06,19.76 13.47,19.35 16.7,19.35 16.88,19.53 R4.2
D-_MCU
  Top 0.15: U2.3 26.2,23.95 23.95,21.7 19.15,21.7 18.75,21.3 18.03,21.3 R4.1
GND  (via drill 0.3)
  Bottom 0.6: v14.5,64.3 15.9,62.9 20.2,62.9 24.1,59 24.1,58.65
  other vias: 15.5,71.3 15,69.5 7.1,68.1 5.1,68.1 3.3,63.1 7.4,63.2 12.4,67.2 25.8,63.8 21.65,30.15 23.65,35.2 1.85,7.7 2.15,19.05 51.9,1.1 47.95,18.65 45.1,9.4 46.65,3.05 52.25,18 41.45,58.6 38.95,58.6 41.4,55.05 47.35,50.75 39.1,43.55 47.4,47.1 47.3,43.45 43.25,43.3 38.55,55.05 52.13,58.27 52.13,53.02 4.05,25.4 4.05,24.1 7.5,25.45 7.5,24.15 5.85,14.95 5.85,12.65 5.85,11.8 11.45,56.1 7.15,47 8.05,48.1 19.55,44.3 25.9,44.25 34.4,43.55 37.6,39.1 39,40.5 35.45,45.4 25.7,46.2 46.5,30.05 48.3,31.1 45.25,21.8 47.5,20.7 42.3,20.2 5.05,19.05 4.1,16.85 7.95,10.35 26.15,20.7 22.75,25.55 16.1,20.9 15.1,15.7 17.8,25.35 5.8,21.85 27.7,30.05 29.7,28 25.45,25.7 25.6,28.15 21.3,23.15 18.75,26.9 33.8,26.5 31.45,24.2 36.7,27 30.9,31.15 36.05,32.2 38.7,27 19.75,32.2 21.2,35.4 27.65,35.5 30.25,34.2 23.05,30.1 26,35.85 34.25,34.05 31.5,36.1 24.05,39.15 22,39.2 40.6,25 42.65,22.7 28.7,40.4 31.05,39.65 33.2,39.6 37.5,30.6 42.85,26.95 44.85,24.95 37.35,36.35 39.6,33.5 41.7,31.45 46.65,37.25 43.8,37.35 45.75,35.15 44.2,32.4 42.45,37.2 40.85,35.65 13.9,32.55 13.9,30.35 31.7,46.2 31.15,43.5 25.1,58.75 27.75,58.75 31.3,58.75 20.8,58.7 19.8,57 33.2,41.65 31.05,41.6 25.9,40.4 25.05,53.2 23.85,51.45 22.65,49.8 25.85,49.85 14,16.65 25.5,7.15 26.35,8.15 33.65,8.4 34.95,4.65 36.95,6.05 36,18.4 38.05,17 43.65,14.2 48.8,20.7 48.9,28.3 29,13.25 51.85,12.3 31.2,14.65 10.45,65.1 30.2,53.95 31.6,52.55 20.85,13.25 25.65,13.15 31.25,21.5 18.65,18.45 16.55,8.25 5.65,8.95 40.7,10.55 25.4,0.85 8,40.6 3.4,54.25 10.6,41.05 11.05,50.65 42.8,4.95 42.8,8.5 46.6,6.75
  pour Top: 2.1,62.5 15.7,62.5 15.7,72.3 2.2,72.2
  pour Bottom: 1.5,73 1.5,60.5 15.7,60.8 15.7,72.9
  pour Top: 54.1,59.2 54.8,13.4 54.4,12.7 41.8,12.75 41.8,13.9 36.7,13.9 36.3,14.3 31.6,14.3 31.6,15 34.6,15 34.6,18.6 21,18.6 21,15 30.8,15 30.8,9.25 33,9.25 33.15,9.1 38.7,9.1 38.7,10.4 39.3,11 41.5,11 41.8,11.3 41.8,11.9 54.3,11.85 54.5,-1.3 -3.3,-1.3 -3.1,16.1 6.1,16.1 6.5,16.05 6.8,16.3 7.55,16.3 9.8,18.55 9.8,23.95 6.1,23.95 6.1,21 -3.1,21 -3,25.7 8.4,25.7 8.4,35 0.4,35 0.9,27.5 -3.1,26.3 -3.5,59.1
  pour Bottom: -2.75,59.1 54.45,59.1 54.5,-1.4 -2.5,-1.4 -2.5,57.5
  pour Top: 18.5,73.1 31,72.88 31,60.15 29.35,60.15 30.65,58.85 28,58.8 26.55,60.3 24.25,60.3 20.6,63.9 18.5,63.9
  pour Bottom: 18.5,73.1 31,72.88 31,60.15 29.35,60.15 30.4,59.1 27.8,59.05 26.55,60.3 24.25,60.3 20.6,63.9 18.5,63.9
  pour Top: 41.8,13.1 55.45,13.1 55.45,11.5 41.8,11.5
  pour Top: 30.7,15 31.7,15 31.7,14.3 30.7,14.3
  pour Top: -3.35,15.9 6.5,15.9 6.65,15.95 6.7,20.2 6.1,20.95 -3.45,21.25 -3.55,21.15 -3.55,16.1
GP2_LED  (via drill 0.3)
  Top 0.15: v23.8,66.1 23.8,62.55 25.65,60.7 26.7,60.7 30.05,57.35 30.05,54.95 32.3,52.7 32.3,44.75 v31.7,44.15 | U2.25 29.2,31.75 29.35,31.9 29.35,34.15 30.9,35.7 30.9,36.3 31.4,36.8 v31.4,36.95
  Bottom 0.15: v31.4,36.95 30.8,36.35 30.35,36.35 29.95,36.75 29.95,37.15 30.35,37.55 30.65,37.55 31.75,38.65 31.75,44.1 v31.7,44.15
  Bottom 0.2: JP2.P$3 23.85,69.75 23.8,69.7
  Bottom 0.3: 23.8,69.7 v23.8,66.1
GP2_OUT  (via drill 0.3)
  Top 0.15: 26.9,61.15 30.4,57.65 30.4,55.1 32.65,52.85 32.65,43.85 v32.55,43.75 | U2.26 28.7,31.95 29,32.25 29,34.3 30.55,35.85 v30.55,36.95
  Top 0.3: TP11.TP 26.9,61.15
  Bottom 0.15: v30.55,36.95 32.1,38.5 32.1,43.3 v32.55,43.75
  Bottom 0.2: 26.85,62.5 TP11.TP
  Bottom 0.3: JP2.P$5 26.85,62.5
INT1  (via drill 0.3)
  Top 0.15: U2.28 27.7,33.25 27.8,33.35 v27.8,33.75 | 28.1,40.15 28.1,45.25 26.1,47.25 22.5,47.25 22.2,47.55 22.2,49.35 21.8,49.75 21.8,51.25 22.05,51.5 U4.11 | 28.1,40.15 28.45,39.8 29.65,39.8 TP21.TP | v27.25,39.75 27.7,39.75 28.1,40.15
  Bottom 0.15: v27.25,39.75 27,39.5 27,34.55 v27.8,33.75
INT2  (via drill 0.3)
  Top 0.15: U2.31 26.2,34.05 v26.05,34.2 | v26.35,39.55 26.35,39.85 26.9,40.4 27.3,40.4 27.75,40.85 27.75,45.1 26.32,46.52 26.25,46.6 25.95,46.9 22.35,46.9 21.85,47.4 21.85,49.2 21.45,49.6 21.45,51.4 21.4,51.45 21.4,52.15 21.75,52.5 U4.9 22.57,53.47 TP22.TP
  Bottom 0.15: v26.35,39.55 26.65,39.25 26.65,34.8 v26.05,34.2
N$1
  Top 0.15: R1.1 5.55,22.65 U1.2
N$2
  Top 0.8: D6.- 17.98,6.95 F1.1 18.1,7.13 18.1,8.15 17.5,8.75 Q7.2
N$3
  pour Top (no thermals): 34.2,18.2 34.2,15.4 21.4,15.4 21.4,18.2
N$4
  Top 0.15: U4.2 C11.2
N$5
  Top 0.15: C3.1 27.7,21.98 U2.6
N$6
  Top 0.15: C4.1 35.29,29.45 X1.1 35.15,28.15 35,28 U2.17
N$7
  Top 0.15: C5.1 35.59,24.55 X1.2 35.15,26.2 33.85,27.5 U2.16
N$8  (via drill 0.3)
  Top 0.15: U2.24 29.7,32.05 30.45,32.8 C6.2 31.45,32.8 32.7,34.05 L2.1 32.7,36.55 31.7,37.55 24.85,37.55 23.7,36.4 23.7,36.2 23.05,35.55 22.2,35.55 v21.7,36.05 | U2.44 23.8,24.95 21.55,24.95 21.2,25.3 C10.1 20.4,25.3 19.55,26.15 18.65,26.15 v17.05,27.75 | v21.7,32.75 21.1,32.15 20.8,32.15 20.6,31.95 20.6,30.45 20,29.85 18.75,29.85 v18.5,30.1
  Bottom 0.15: v21.7,32.75 21.7,33.2 21.95,33.45 21.95,35.8 v21.7,36.05 | v17.05,27.75 17.8,28.5 17.8,29.4 v18.5,30.1
N$9
  Top 0.6: Q3.1 IC3.5
N$10
  Top 0.2: U6.P$28 U6.P$27
N$11
  Top 0.15: C9.2 21.8,27 22.55,26.25 22.95,26.25 23.2,26.5 U2.42
N$12
  Top 0.8: F1.2 20.35,7.1 18,4.75 S1.2
N$13
  Top 0.15: R2.1 R2.2
N$14
  Top 0.15: R2.6 R2.7
N$15
  Top 0.15: R2.3 R2.4
N$16
  Top 0.2: U6.P$30 U6.P$29
N$17
  Top 0.4: Q5.3 41.4,2.2 R12.1
N$18
  Top 0.4: Q4.3 41.2,5.8 R10.1
N$19
  Top 0.4: Q2.3 41.2,9.4 R9.1
N$20
  Top 0.8: JP3.1 16.52,54.17 15.75,53.4 11.1,53.4 8.4,56.1 6.5,56.1 6,55.6 C27.2 | C27.2 6,54.55 | Q1.3 5.95,50.5 5.15,51.3 5.15,52.05 4.6,52.6 | 4.6,52.6 5.15,53.15 5.15,53.85 C27.2 | 4.6,52.6 D2.+
N$21
  Top 0.2: R7.1 28.2,67.5 27.7,68 24.3,68 22.1,65.8 C28.+
  Top 0.3: JP2.P$1 20.85,68.45 20.2,67.8 C28.+
  Top 0.4: C28.+
N$22  (via drill 0.3)
  Top 0.15: v29.25,22.7 29.25,22.3 29.15,22.2 29.15,20.2 28.4,19.45 20.75,19.45 19.22,17.92 R19.2 C22.1 | v22.65,27.7 22.85,27.5 U2.40
  Bottom 0.15: v29.25,22.7 28.6,22.7 27.3,24 27.3,25.8 25.65,27.45 22.9,27.45 v22.65,27.7
N$23
  Top 0.2: R7.2 R8.1
N$24
  Top 0.2: C24.1 8.8,70.6 IC1.P$5
N$25
  Top 0.15: U6.P$6 36.23,48.43 35.7,47.9 35.3,47.9 34.9,48.3
  Top 0.2: 34.9,48.3 34.75,48.45
  Top 0.4: 34.75,48.45 TX.1
N$26  (via drill 0.3)
  Top 0.15: U6.P$7 37.33,47.25 v36.15,47.25
  Bottom 0.15: v36.15,47.25 35.5,47.9 35.2,47.9 34.9,48.2 34.9,48.9 35,49 SJ1.2
N$27  (via drill 0.3)
  Top 0.15: U6.P$5 36.33,49.63 35.95,49.25 35.95,48.95 v35.5,48.5
  Bottom 0.15: v35.5,48.5 36.2,49.2 36.2,50.45 35.9,50.75 SJ1.1 SJ2.2
N$28
  Top 0.15: U6.P$8 36.17,46.03 34.7,47.5
  Top 0.2: 34.7,47.5 34.1,48.1
  Top 0.4: RX.1 34.1,54 34.1,48.2 34.1,48.1
N$29
  Top 0.4: 40.2,57.35 U6.P$35
  Top 0.8: ANT1.1 40.2,62.2
  Top 1.27: 40.2,62.2 40.2,57.35
N$32
  Top 0.4: D4.4 D3.4 33.84,4.5 35.65,2.7 38.85,2.7 40.1,3.95 40.1,6.9 R9.2
N$33
  Top 0.4: D4.3 D3.3 34.27,3.23 35.4,2.1 39.1,2.1 41.1,4.1 R10.2
N$34
  Top 0.4: R11.1 R12.2
N$37
  Top 0.4: D4.1 31.74,0.7 32.35,0.7 | 32.35,0.7 32.4,0.7 34.3,0.7 34.75,1.15 R11.2 | D3.1 32.35,0.7
N$39
  Top 0.15: R14.3 R14.4 40.2,40.26 U6.P$12
N$40
  Top 0.15: R14.2 R14.1 43.61,39.66 43.8,39.85 U6.P$15
N$41
  Top 0.15: R13.4 R13.3 45.22,40.32 45.45,40.55 46.05,40.55 46.2,40.7 U6.P$17
N$42  (via drill 0.3)
  Top 0.15: U6.P$26 51.07,52.03 52.6,50.5 52.6,44.05 52.05,43.5 v52.05,42.8 | v50.95,41.7 50.95,40.8 49.8,39.65 46.85,39.65 R13.1 R13.2
  Bottom 0.15: v52.05,42.8 v50.95,41.7
N$43
  Top 0.15: U2.33 24.3,31.35 TP2.TP
PWM_B  (via drill 0.3)
  Top 0.15: U2.27 28.2,32.9 28.55,33.25 v28.55,34.65 29.2,35.3 29.2,35.7 29,35.9 29,36.65 28.45,37.2 25,37.2 24.35,36.55 24.35,34.9 24,34.55 23.3,34.55 23.1,34.75 21.35,34.75 21.1,34.5 20.6,34.5 20.36,34.74 R6.4 | v36.45,35.1 36.45,34.7 40.95,30.2 40.95,27 45.85,22.1 45.85,11.45 46.6,10.7 TP14.TP Q2.1
  Bottom 0.15: v28.55,34.65 28.7,34.8 36.15,34.8 v36.45,35.1
PWM_G  (via drill 0.3)
  Top 0.15: R6.3 19.53,34.52 19.9,34.15 21.25,34.15 21.5,34.4 22.95,34.4 23.15,34.2 24.15,34.2 24.7,34.75 24.7,36.4 25.15,36.85 28.3,36.85 28.65,36.5 28.65,35.6 v28.55,35.5 28.45,35.5 27.2,34.25 U2.29 | v35.85,35.65 35.9,35.7 36.65,35.7 37.05,35.3 37.05,34.9 37,34.85 37,34.65 41.3,30.35 41.3,27.15 46.25,22.2 46.25,11.65 47.6,10.3 47.6,5.85 TP13.TP Q4.1
  Bottom 0.15: v28.55,35.5 28.55,35.7 29.3,35.7 29.85,35.15 35.35,35.15 v35.85,35.65
PWM_MOTOR
  Top 0.15: Q1.1 5.25,47.25 6.2,46.3 6.2,43.9 5.5,43.2 4.4,43.2 3.6,42.4 3.6,41.2 5.8,39 5.8,38.3 5.9,38.2 8,38.2 8.5,38.7 9.7,38.7 10.3,39.3 10.3,40.1 10.5,40.3 11.4,40.3 11.6,40.1 11.6,38.9 10.6,37.9 9.6,37.9 9.3,37.6 9.3,36.6 9.6,36.3 9.7,36.3 | 9.7,36.3 11.6,36.3 12.2,36.9 16.3,36.9 17.76,35.44 R6.1 17.95,34.45 18.95,33.45 21.55,33.45 21.8,33.7 22.65,33.7 22.85,33.5 24.2,33.5 25.7,32 U2.32 | TP15.TP 9.7,35.35 9.7,36.3
PWM_R  (via drill 0.3)
  Top 0.15: R6.2 18.77,34.48 19.45,33.8 21.4,33.8 21.65,34.05 22.8,34.05 23,33.85 24.3,33.85 25.05,34.6 25.05,34.85 | U2.30 26.7,34.35 26.2,34.85 25.05,34.85 | 25.05,34.85 25.05,36.25 25.3,36.5 27.8,36.5 v28.05,36.25 | v35.55,36.45 35.85,36.45 36.25,36.05 36.8,36.05 37.4,35.45 37.4,34.75 41.65,30.5 41.65,27.3 46.65,22.3 46.65,11.8 47.95,10.5 47.95,2.6 TP12.TP Q5.1 45.3,1.25
  Bottom 0.15: v28.05,36.25 28.15,36.15 29.35,36.15 30,35.5 34.05,35.5 35,36.45 v35.55,36.45
SCL_3.3V  (via drill 0.3)
  Top 0.15: IC1.P$4 8.3,65.3 v9.9,63.7 10.7,62.9 20.2,62.9 23.9,59.2 23.9,57.1 TP9.TP | v14,67.1 14.3,67.4 U7.6 | U2.18 32.5,28.5 33.5,29.5 33.5,30.45 34.95,31.9 v34.95,32.5 | v39,35.45 39,36.85 38.55,37.3 37.05,37.3 33.45,40.9 30.8,40.9 29.85,41.85 | 29.85,41.85 29.8,41.9 29.7,42 29.7,46.1 30.5,46.9 30.5,49.2 R16.1 28.55,50 28.1,50.45 28.1,51.75 26.75,53.1 26.75,53.6 26.25,54.1 26.25,54.75 TP9.TP | 29.85,41.85 29.9,41.85 v30.3,42.25 | v22.65,43.7 19.7,43.7 17,41 J3.1 | v25.3,54.05 26.05,53.3 26.05,52.45 25.6,52 U4.4 | 25,55.95 TP9.TP
  Bottom 0.15: v9.9,63.7 11.15,63.7 14,66.55 v14,67.1 | v34.95,32.5 35.25,32.8 36.8,32.8 39,35 v39,35.45 | v30.3,42.25 29.5,42.25 28.7,41.45 25.45,41.45 23.95,42.95 23.95,43.25 23.5,43.7 v22.65,43.7
  Bottom 0.2: v25.3,54.05 25,54.35 TP9.TP
SDA_3.3V  (via drill 0.3)
  Top 0.15: IC1.P$3 7.04,64.77 v8.8,63 9.3,62.5 20,62.5 23.55,58.95 23.55,57.05 TP8.TP 23.9,54.6 | U7.1 14.75,70.85 15.6,70 15.6,69 14.9,68.3 v14.9,66.7 | U2.19 32.5,29 33.15,29.65 33.15,30.6 34.35,31.8 v34.35,33.15 | 23.9,54.6 23.95,54.65 25.55,54.65 25.9,54.3 25.9,53.95 26.4,53.45 26.4,52.95 27.75,51.6 27.75,49.85 29.1,48.5 R15.1 30.15,48.05 30.15,47.15 29.35,46.35 29.35,41.3 | v38.3,36.05 38.65,36.4 38.65,36.7 38.4,36.95 36.9,36.95 33.3,40.55 30.6,40.55 29.85,41.3 29.35,41.3 | 29.35,41.3 v29.15,41.1 | J3.2 19,41.25 20.85,43.1 v23.3,43.1 | 23.9,54.6 23.9,54.3 24.35,53.85 U4.6
  Bottom 0.15: v8.8,63 11.2,63 v14.9,66.7 | v34.35,33.15 36.65,33.15 38.3,34.8 v38.3,36.05 | v29.15,41.1 25.3,41.1 v23.3,43.1
TCK  (via drill 0.3)
  Top 0.15: JP1.1 13.9,25.19 13.9,27.4 14.5,28 16.15,28 16.7,28.55 17.15,28.55 17.65,28.05 18.45,28.05 v18.75,27.75 | v20.95,28.2 21.9,28.2 22,28.3 23.3,28.3 23.6,28 U2.39
  Bottom 0.15: v18.75,27.75 19.2,28.2 v20.95,28.2
TDI
  Top 0.15: U2.36 18.2,29.5 17.65,30.05 17.65,30.7 17,31.35 17,32.4 16.35,33.05 14.16,33.05 JP1.9
TDO  (via drill 0.3)
  Top 0.15: U2.37 23.75,29 23.6,29.15 18.05,29.15 17.05,30.15 v17.05,30.5 | v11.35,29.75 11.35,27.99 JP1.3
  Bottom 0.15: v11.35,29.75 12.1,30.5 13.05,30.5 13.65,31.1 14.15,31.1 14.75,30.5 v17.05,30.5
TMS
  Top 0.15: U2.38 23.75,28.5 23.45,28.8 17.9,28.8 16.2,30.5 14.9,30.5 13.65,29.25 JP1.5
V_TEMP
  Top 0.2: IC1.P$7 5.76,71.06 6.2,71.5 11.3,71.5 11.5,71.3 11.5,66.1 C25.1 C26.1 | U7.5 13.3,66.1 C26.1 | C26.1 14.2,66 15.35,64.85 15.35,64.1 16.1,63.35 20.4,63.35 24.3,59.45 24.3,58.65 24.85,58.1 27.4,58.1 28.9,56.6 28.9,54.9 29.5,54.3 29.5,53.2 R18.1 R17.2
VBAT  (via drill 0.3)
  Top 0.15: Q7.3 16.55,15.3 16.7,15.45 17.05,15.45 R19.1
  Top 0.8: Q7.3 15.5,14.6 v12.55,11.65 v11.8,11.65 | v4.1,28 4.1,28.4 4.2,28.5
  Bottom 0.8: v12.55,11.65 v11.8,11.65 7.65,11.65 6.2,10.2 4.1,10.2 3.1,11.2 3.1,26.2 v4.1,27.2 v4.1,28
  pour Top: 3.8,26.1 8,26.1 8,34.6 3.8,34.6
VRAW  (via drill 0.3)
  Top 0.15: 19.35,9.6 18.2,10.75 18.2,15.1 20.55,17.45 20.55,18.65 21,19.1 28.55,19.1 29.5,20.05 29.5,21.7 29.85,22.05 v29.85,22.1 | v22.75,26.85 22.9,27 U2.41
  Top 0.4: L1.P$1 22.9,9.7
  Top 0.6: 22.9,9.7 IC3.1
  Top 0.8: S1.3 20,4.55 21.15,5.7 22.35,5.7 22.6,5.95 22.6,7.05 C13.1 22.55,9.55 L1.P$1 22.9,9.6 19.35,9.6 TP3.TP
  Bottom 0.15: v29.85,22.1 28.7,22.1 26.95,23.85 26.95,25.65 25.5,27.1 23,27.1 v22.75,26.85
VUSB
  Top 0.15: D5.+ 4.8,39.3 5.3,38.8 5.3,38.2 5.7,37.8 8.7,37.8 9.2,38.3 10.1,38.3 10.95,39.15 Q6.1 | 14,21.15 14.65,21.8 16.4,21.8 19,19.2 20,19.2 20.6,19.8 28.2,19.8 28.8,20.4 28.8,22.35 28.2,22.95 U2.7
  Top 0.2: Q7.1 15.6,10.45
  Top 0.4: 15.6,10.45 D6.+ | 4.4,14.85 4.4,14.62 J1.1 3.3,14.6 | U3.5 14,21.15 13.4,21.75 12.65,21.75 12.2,21.3 12.2,20.6 11.85,20.25 10.05,20.25 9.7,19.9 9.1,19.9 9.05,19.95 9.05,19.9
  Top 0.8: 15.4,10.2 15.45,10.25 D6.+ 11,10.25 9.9,9.15 7.2,9.15 6.2,10.15 4.15,10.15 3.1,11.2 3.1,14.4 3.3,14.6 | C1.1 8.17,17.87 6.45,16.15 5.1,16.15 | 5.1,16.15 4.4,15.45 4.4,14.85 | D5.+ 3.1,38.75 3.1,19.5 5.1,17.5 5.1,16.15
  pour Top: 6.5,23.55 9.4,23.55 9.4,18.75 7.35,16.7 7.2,16.7 7.2,20.4 6.5,21.1
WIFI_CS  (via drill 0.3)
  Top 0.15: U2.21 31.8,30 32,30.2 v32,31.5 | v41.4,33.05 41.4,33.7 TP17.TP 40.25,34.85 40.25,36 40.95,36.7 41.35,36.7 41.65,37 41.65,38.11 R14.6
  Bottom 0.15: v32,31.5 33.95,31.5 34.3,31.15 36.55,31.15 37.05,31.65 39.85,31.65 40.9,32.7 41.05,32.7 v41.4,33.05
WIFI_ENABLE  (via drill 0.3)
  Top 0.15: U2.8 28.7,24.2 30,22.9 30.45,22.9 30.8,22.55 32.75,22.55 33.3,22 39.85,22 40.3,22.45 v41,22.45 | v45.9,27 45.9,33 47.3,34.4 | 47.3,34.4 47.3,37.64 R13.8 | 47.3,34.4 47.7,34 TP16.TP
  Bottom 0.15: v41,22.45 41.45,22.45 44.9,25.9 45.15,25.9 45.9,26.65 v45.9,27
WIFI_IRQ  (via drill 0.3)
  Top 0.15: U2.20 32.15,29.5 32.65,30 v32.65,30.85 | U6.P$14 v42.6,40.65 | v41.9,32.35 42.55,32.35 TP18.TP 44.8,34.6 v44.8,35.55
  Bottom 0.15: v32.65,30.85 32.95,31.15 33.8,31.15 34.15,30.8 36.7,30.8 37.2,31.3 40,31.3 41.05,32.35 v41.9,32.35 | v44.8,35.55 44.8,38.45 v42.6,40.65
WIFI_MISO  (via drill 0.3)
  Top 0.15: U2.11 30.2,24.2 30.45,23.95 30.9,23.95 31.25,23.6 33.2,23.6 33.75,23.05 39.15,23.05 40.25,24.15 v40.65,24.15 | U6.P$13 v41.4,40.65 | v47.3,32.2 47.75,31.75 48.5,31.75 48.9,31.35 48.9,30.6 46.5,28.2 46.5,26.7 45.65,25.85 44.65,25.85 43.95,26.55 v43.95,27.15 43.95,28.25 TP26.TP
  Bottom 0.15: v40.65,24.15 41.6,24.15 43.95,26.5 v43.95,27.15 | v41.4,40.65 41.8,40.65 42.4,40.05 42.65,40.05 44.45,38.25 44.45,36.1 44.2,35.85 44.2,35.3 v47.3,32.2
WIFI_MOSI  (via drill 0.3)
  Top 0.15: U2.10 29.7,24.2 30.3,23.6 30.75,23.6 31.1,23.25 33.05,23.25 33.6,22.7 39.35,22.7 40.05,23.4 v40.3,23.4 40.7,23.4 41.1,23.8 41.55,23.8 41.95,23.4 41.95,22.05 41.6,21.7 41.6,20.8 41.2,20.4 39.7,20.4 TP25.TP | v44.7,27.5 44.7,27.85 44.95,28.1 44.95,33.05 46.6,34.7 46.6,35.9 46.2,36.3 45.6,36.3 45.2,36.7 43.6,36.7 43.2,37.1 R14.8
  Bottom 0.15: v40.3,23.4 40.7,23.4 41.1,23.8 41.75,23.8 44.3,26.35 44.3,26.7 44.7,27.1 v44.7,27.5
WIFI_SCK  (via drill 0.3)
  Top 0.15: U2.9 29.2,24.2 30.15,23.25 30.6,23.25 30.95,22.9 32.9,22.9 33.45,22.35 39.6,22.35 40.05,22.8 40.5,22.8 40.75,23.05 41.2,23.05 v41.35,23.2 41.6,22.95 41.6,22.2 TP24.TP | v44.9,26.5 45.3,26.9 45.3,32.9 46.95,34.55 46.95,36.05 46.35,36.65 45.75,36.65 45.3,37.1 45.3,38.06 R13.6
  Bottom 0.15: v41.35,23.2 41.6,23.45 41.9,23.45 44.9,26.45 v44.9,26.5

### Text on the board
Top: Top Cu
Bottom: Bottom Cu
tPlace: 9 | + | - | 1 | D3 | V2.2 | 07/2015
bPlace: TP11 | TP8 | RX | TX | TP9 | TP10 | TP7 | - | 9 | TP6 | + | TP5 | 1 | TP1 | TP3 | TP4 | TP27 | D4
Mecanical: 72 | Spacer | Spacer | Cylinder | Cylinder | Led Pipe | External envelope of cylinder | Led Pipe | External envelope of cylinder | 0,0 | Bottom plate | Bottom plate | 53 | Center of cylinder